# EAGLE design power_board (EAGLE 9.6.2)
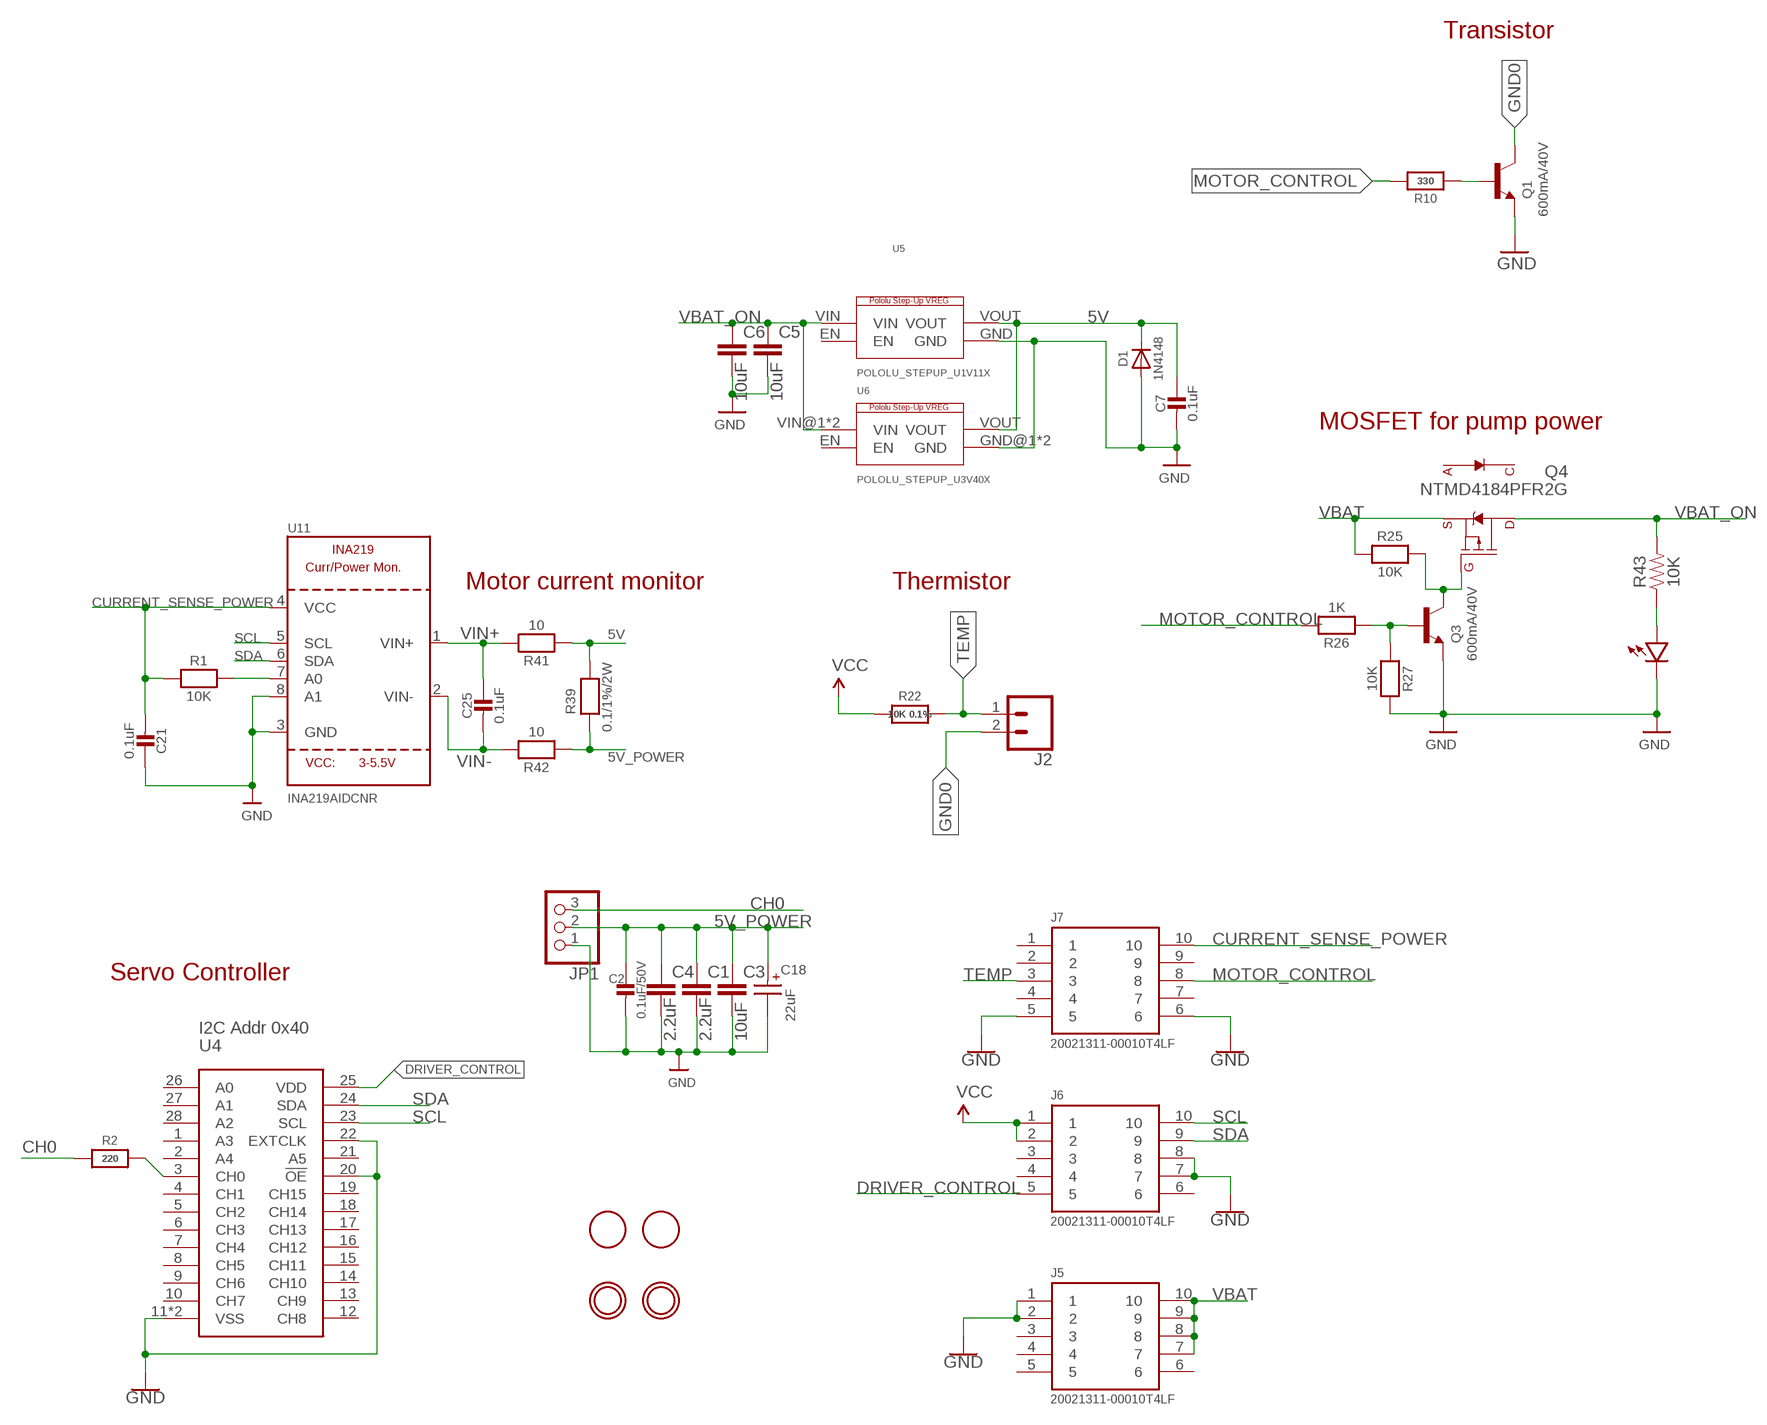
[diagram p0: schematic, sheet 1]

## Parts
C1  2.2uF  CAP1206  [1206]
C2  0.1uF/50V  CAP_CERAMIC0805-NOOUTLINE  [0805-NO]
C3  10uF  CAP0805  [0805]
C4  2.2uF  CAP1206  [1206]
C5  10uF  CAP1206  [1206]
C6  10uF  CAP1206  [1206]
C7  0.1uF  MICROBUILDER_CAP_CERAMIC_0402MP  [MICROBUILDER__0402MP]
C18  22uF  WCAP-ATLL_5X11_860160672011  [WCAP-ATLL_5X11(DXL)]
C21  0.1uF  MICROBUILDER_CAP_CERAMIC_0402MP  [MICROBUILDER__0402MP]
C25  0.1uF  MICROBUILDER_CAP_CERAMIC_0402MP  [MICROBUILDER__0402MP]
D1  1N4148  DIODESOD-323  [SOD-323]
J2  CONN_02  [1X02]
J5  20021311-00010T4LF  [HEADER_1.27MM_2X5]
J6  20021311-00010T4LF  [HEADER_1.27MM_2X5]
J7  20021311-00010T4LF  [HEADER_1.27MM_2X5]
JP1  PINHD-1X3  [1X03]
LED1  BLUE  LED0805  [0805-LED]
Q1  600mA/40V  TRANS_NPN-MMBT2222AL  [SOT23-3]
Q3  600mA/40V  TRANS_NPN-MMBT2222AL  [SOT23-3]
Q4  NTMD4184PFR2G  [SOIC-8]
R1  10K  MICROBUILDER_RESISTOR_0402MP  [MICROBUILDER__0402MP]
R2  220  MICROBUILDER_RESISTOR_0402MP  [MICROBUILDER__0402MP]
R10  330  MICROBUILDER_RESISTOR_0402MP  [MICROBUILDER__0402MP]
R22  10K 0.1%  MICROBUILDER_RESISTOR_0402MP  [MICROBUILDER__0402MP]
R25  10K  MICROBUILDER_RESISTOR_0402MP  [MICROBUILDER__0402MP]
R26  1K  MICROBUILDER_RESISTOR_0402MP  [MICROBUILDER__0402MP]
R27  10K  MICROBUILDER_RESISTOR_0402MP  [MICROBUILDER__0402MP]
R39  0.1/1%/2W  RESISTOR2512  [2512]
R41  10  MICROBUILDER_RESISTOR_0402MP  [MICROBUILDER__0402MP]
R42  10  MICROBUILDER_RESISTOR_0402MP  [MICROBUILDER__0402MP]
R43  10K  RESISTOR0805  [0805]
U4  PCA9685HVQFN28  [HVQFN28_SOT788-1]
U5  POLOLU_STEPUP_U1V11X  [POLOLU_STEPUP_U1V11X]
U6  POLOLU_STEPUP_U3V40X  [POLOLU_STEPUP_U3V40X]
U11  INA219AIDCNR  INA219  [SOT23-8]
U$2  MOUNTINGHOLE2.5  [MOUNTINGHOLE_2.5_PLATED]
U$3  MOUNTINGHOLE2.5  [MOUNTINGHOLE_2.5_PLATED]
U$8  FIDUCIAL  [FIDUCIAL_1MM]
U$9  FIDUCIAL  [FIDUCIAL_1MM]

## Nets
5V: C7.1 D1.C R39.2 R41.1 U5.VOUT U6.VOUT
5V_POWER: C1.1 C2.1 C3.1 C4.1 C18.1(+) JP1.2 R39.1 R42.1
CH0: JP1.3 R2.1
CURRENT_SENSE_POWER: C21.2 J7.10 R1.1 U11.4(VCC)
DRIVER_CONTROL: J6.5 U4.25(VDD)
GND [power]: C1.2 C2.2 C3.2 C4.2 C5.2 C6.2 C7.2 C18.2(-) C21.1 D1.A J5.1 J5.2 J6.7 J6.8 J7.5 J7.6 JP1.1 LED1.MINUS Q1.2(E) Q3.2(E) R27.2 U4.11(VSS) U4.20(!OE) U4.22(EXTCLK) U4.TH(VSS) U5.GND U6.GND@1(GND) U6.GND@2(GND) U11.3(GND) U11.8(A1)
GND0: J2.2 Q1.3(C)
MOTOR_CONTROL: J7.8 R10.2 R26.2
N$1 [power]: R1.2 U11.7(A0)
N$7: Q1.1(B) R10.1
N$9: R2.2 U4.3(CH0)
N$11: LED1.PLUS R43.1
N$32: Q3.3(C) Q4.4(G) R25.2
N$33: Q3.1(B) R26.1 R27.1
SCL: J6.10 U4.23(SCL) U11.5(SCL)
SDA: J6.9 U4.24(SDA) U11.6(SDA)
TEMP: J2.1 J7.3 R22.2
VBAT: J5.7 J5.8 J5.9 J5.10 Q4.3(S) R25.1
VBAT_ON [power]: C5.1 C6.1 Q4.5(D) Q4.6(D) R43.2 U5.VIN U6.VIN@1(VIN) U6.VIN@2(VIN)
VCC: J6.1 J6.2 R22.1
VIN+: C25.1 R41.2 U11.1(VIN+)
VIN-: C25.2 R42.2 U11.2(VIN-)
Unconnected: J5.3 J5.4 J5.5 J5.6 J6.3 J6.4 J6.6 J7.1 J7.2 J7.4 J7.7 J7.9 Q4.1(A) Q4.2(A) Q4.7(C) Q4.8(C) U4.1(A3) U4.2(A4) U4.4(CH1) U4.5(CH2) U4.6(CH3) U4.7(CH4) U4.8(CH5) U4.9(CH6) U4.10(CH7) U4.12(CH8) U4.13(CH9) U4.14(CH10) U4.15(CH11) U4.16(CH12) U4.17(CH13) U4.18(CH14) U4.19(CH15) U4.21(A5) U4.26(A0) U4.27(A1) U4.28(A2) U5.EN U6.EN

## Notes on the sheet
- Transistor
- MOSFET for pump power
- Motor current monitor | Thermistor
- Servo Controller
- I2C Addr 0x40

## Library data of the parts
C1 C3-C6 = SparkFun-Passives:CAP: Capacitor Standard 0603 ceramic capacitor, and 0.1" leaded capacitor.
C2 = microbuilder:CAP_CERAMIC: Ceramic Capacitors For new designs, use the packages preceded by an '_' character since they are more reliable: The following footprints should be used on most boards: _0402 - Standard footprint for regular board layouts _0603 - Standard footprint for regular board layouts _0805 - Standard footprint for regular board layouts _1206 - Standard footprint for regular board layouts For extremely tight-pitch boards where space is at a premium, the following 'micro-pitch' footprints can be used (smaller pads, no silkscreen outline, etc.): _0402MP - Micro-pitch footprint for very dense/compact boards _0603MP - Micro-pitch footprint for very dense/compact boards _0805MP - Micro-pitch footprint for very dense/compact boards _1206MP - Micro-pitch footprint for very dense/compact boards
C7 C21 C25 = Adafruit Feather 32u4 Bluefruit LE:MICROBUILDER_CAP_CERAMIC: Ceramic Capacitors For new designs, use the packages preceded by an '_' character since they are more reliable: The following footprints should be used on most boards: _0402 - Standard footprint for regular board layouts _0603 - Standard footprint for regular board layouts _0805 - Standard footprint for regular board layouts _1206 - Standard footprint for regular board layouts For extremely tight-pitch boards where space is at a premium, the following 'micro-pitch' footprints can be used (smaller pads, no silkscreen outline, etc.): _0402MP - Micro-pitch footprint for very dense/compact boards _0603MP - Micro-pitch footprint for very dense/compact boards _0805MP - Micro-pitch footprint for very dense/compact boards _1206MP - Micro-pitch footprint for very dense/compact boards; MPN: GRM155R71C104KA88J
C18 = 860160672011_Eagle_WCAP-ATLL_rev20a:WCAP-ATLL_5X11: WCAP-ATLL Aluminum Electrolytic Capacitors Long Life +105 °C Characteristics Long life product series Mounting style: THT Radial Capacitance range: 0.47 µF ‒ 6800 µF Capacitance tolerance: ±20 % Voltage range (UR): 10 ‒ 50 V(DC) Operating temperature: -55 °C up to +105 °C Endurance: 3000 ‒ 10000 h @ +105 °C Dimensions (DxL) in mm: 5.0 x 11.0 up to 18.0 x 35.5 Recommended soldering: Wave soldering Applications Long life application Filtering Smoothing Energy storage Coupling e.g. Switched-mode power supply, AC/DC converter, adapter, charger, digital camera <https://www.we-online.com/catalog/media/o14730v209%20Family_WCAP-ATLL.jpg> Details see: https://www.we-online.com/catalog/en/WCAP-ATLL/ Updated by yingchun,Shan;2020-03-02 2020(C) Würth Elektronik; DATASHEET-URL: https://www.we-online.com/catalog/datasheet/860160672011.pdf; DF: 10%; DIAMETER: 5mm; I-LEAK: 11uA; I-RIPPLE: 162mA; L: 11mm; MPN: 860160672011; OPERATING-TEMPERATURE: -55 °C up to +105 °C; PART-NUMBER: 860160672011; PITCH: 2mm; TECHNICAL-REFERENCE: ATEC110220M050DSPA3C000; VALUE: 22 µF; VR: 50V(DC)
D1 = microbuilder:DIODE: Diode SMA Model Volts Amps Type Vf Ir Digikey # Notes SSA34-E3 40V 3A Schottky 480mV @ 3A 200uA @ 40V SSA34-E3/61TGITR-ND CDBA120-G 20V 1A Schottky 500mV @ 1A 500uA @ 20V 641-1014-6-ND REEL MBRA210 10V 2A Schottky 350mV @ 2A 700uA @ 10V MBRA210LT3 SOD-123 Model Volts Amps Type Vf Ir Order # Notes BAT54T1G 30V 200mA Schottky 800mV @ 200mA 2uA @ 25V BAT54T1GOSTR-ND B0530W 30V 500mA Schottky 430mV @ 500mA 130uA @ 30V B0530W-FDICT-ND REEL MBR120 20V 1A Schottky 340mV @ 1A MBR120VLSFT1GOSCT-ND SOD-323 Model Volts Amps Type Vf Ir Order # Notes PMEG2005EJ 20V 500mA Schottky 355mV @ 500mA 568-4110-1-ND ZLLS410 10V 570mA Schottky 380mV @ 570mA ZLLS410CT-ND 1N4148WS 75V 150mA Silicon/Simple 1V 1N4148WSFSCT-ND REEL SOD-523 Model Volts Amps Type Vf Ir Order # Notes BAT54XV2 30V 200mA Schottky 0.8V @ 100mA BAT54XV2CT-ND TB751S 30V 30mA Schottky RB751S-40TE61CT-ND SOT23-R/W (R = Solder Paste/Reflow Ovens, W = Hand-Soldering) Model Volts Amps Type Vf Ir Order # Notes BAT54FILM 40V 300mA Schottky 497-7162-1-ND POWERDI-5 Model Volts Amps Type Vf Ir Order # Notes PDS560 60V 5A Schottky 670mV @ 5A 150uA @ 60V PDS560DICT-ND; MPN: 1N4148WX-TP
J2 = SparkFun-Connectors:CONN_02: Multi connection point. Often used as Generic Header-pin footprint for 0.1 inch spaced/style header connections On any of the 0.1 inch spaced packages, you can populate with these: Break Away Headers - Straight <https://www.sparkfun.com/products/116> (PRT-00116) Break Away Male Headers - Right Angle <https://www.sparkfun.com/products/553> (PRT-00553) Female Headers <https://www.sparkfun.com/products/115> (PRT-00115) Break Away Headers - Machine Pin <https://www.sparkfun.com/products/117> (PRT-00117) Break Away Female Headers - Swiss Machine Pin <https://www.sparkfun.com/products/743> (PRT-00743) For SCREWTERMINALS and SPRING TERMINALS visit here: Screw Terimnals on SparkFun.com <https://www.sparkfun.com/search/results?term=Screw+Terminals> (5mm/3.5mm/2.54mm spacing) This device is also useful as a general connection point to wire up your design to another part of your project. Our various solder wires solder well into these plated through hole pads. Hook-Up Wire - Assortment (Stranded, 22 AWG) <https://www.sparkfun.com/products/11375> (PRT-11375) Hook-Up Wire - Assortment (Solid Core, 22 AWG) <https://www.sparkfun.com/products/11367> (PRT-11367) View the entire wire category on our website here <https://www.sparkfun.com/categories/141> Special notes: Molex polarized connector foot print use with: PRT-08233 with associated crimp pins and housings. 2.54_SCREWTERM for use with PRT-10571. 3.5mm Screw Terminal footprints for PRT-08084 5mm Screw Terminal footprints for use with PRT-08432
J5-J7 = Amphenol:20021311-00010T4LF
JP1 = adafruit:PINHD-1X3: PIN HEADER
LED1 = LowPowerLab:LED; MPN: 150080BS75000
Q1 Q3 = SparkFun-DiscreteSemi:TRANS_NPN: NPN transistor Current controlled devices typically used to amplify current or used as a switch. BC547 - COM-08928 <http://www.sparkfun.com/products/8928> (TO-92 45V 100mA) (1.Collector 2.Base 3.Emitter) 2N3904 - COM-00521 <http://www.sparkfun.com/products/521> (TO-92 40V 200mA) (1.Emitter 2.Base 3.Collector) P2N2222A - COM-12852 <http://www.sparkfun.com/products/12852> (TO-92 40V 600mA) (1.Collector 2.Base 3.Emitter); MPN: MMBT3904-TP; PROD_ID: TRANS-08049
Q4 = NTMD4184PFR2G:NTMD4184PFR2G: MOSFET – Power, Single, P-Channel, Schottky Diode, Schottky Barrier Diode -30 V, -4.0 A, 20 V, 2.2A MPN: NTMD4184PFR2G Designed by AKstudios github.com/akstudios; MPN: NTMD4184PFR2G
R1 R25 R27 = Adafruit Feather 32u4 Bluefruit LE:MICROBUILDER_RESISTOR: Resistors For new designs, use the packages preceded by an '_' character since they are more reliable: The following footprints should be used on most boards: _0402 - Standard footprint for regular board layouts _0603 - Standard footprint for regular board layouts _0805 - Standard footprint for regular board layouts _1206 - Standard footprint for regular board layouts For extremely tight-pitch boards where space is at a premium, the following 'micro-pitch' footprints can be used (smaller pads, no silkscreen outline, etc.): _0402MP - Micro-pitch footprint for very dense/compact boards _0603MP - Micro-pitch footprint for very dense/compact boards _0805MP - Micro-pitch footprint for very dense/compact boards _1206MP - Micro-pitch footprint for very dense/compact boards; MPN: RC0402FR-7W10KL
R2 = Adafruit Feather 32u4 Bluefruit LE:MICROBUILDER_RESISTOR: Resistors For new designs, use the packages preceded by an '_' character since they are more reliable: The following footprints should be used on most boards: _0402 - Standard footprint for regular board layouts _0603 - Standard footprint for regular board layouts _0805 - Standard footprint for regular board layouts _1206 - Standard footprint for regular board layouts For extremely tight-pitch boards where space is at a premium, the following 'micro-pitch' footprints can be used (smaller pads, no silkscreen outline, etc.): _0402MP - Micro-pitch footprint for very dense/compact boards _0603MP - Micro-pitch footprint for very dense/compact boards _0805MP - Micro-pitch footprint for very dense/compact boards _1206MP - Micro-pitch footprint for very dense/compact boards; MPN: RC0402JR-071KL
R10 = Adafruit Feather 32u4 Bluefruit LE:MICROBUILDER_RESISTOR: Resistors For new designs, use the packages preceded by an '_' character since they are more reliable: The following footprints should be used on most boards: _0402 - Standard footprint for regular board layouts _0603 - Standard footprint for regular board layouts _0805 - Standard footprint for regular board layouts _1206 - Standard footprint for regular board layouts For extremely tight-pitch boards where space is at a premium, the following 'micro-pitch' footprints can be used (smaller pads, no silkscreen outline, etc.): _0402MP - Micro-pitch footprint for very dense/compact boards _0603MP - Micro-pitch footprint for very dense/compact boards _0805MP - Micro-pitch footprint for very dense/compact boards _1206MP - Micro-pitch footprint for very dense/compact boards; MPN: RC0402JR-0710KL
R22 = Adafruit Feather 32u4 Bluefruit LE:MICROBUILDER_RESISTOR: Resistors For new designs, use the packages preceded by an '_' character since they are more reliable: The following footprints should be used on most boards: _0402 - Standard footprint for regular board layouts _0603 - Standard footprint for regular board layouts _0805 - Standard footprint for regular board layouts _1206 - Standard footprint for regular board layouts For extremely tight-pitch boards where space is at a premium, the following 'micro-pitch' footprints can be used (smaller pads, no silkscreen outline, etc.): _0402MP - Micro-pitch footprint for very dense/compact boards _0603MP - Micro-pitch footprint for very dense/compact boards _0805MP - Micro-pitch footprint for very dense/compact boards _1206MP - Micro-pitch footprint for very dense/compact boards; MPN: RC0402JR-0727RL
R26 = Adafruit Feather 32u4 Bluefruit LE:MICROBUILDER_RESISTOR: Resistors For new designs, use the packages preceded by an '_' character since they are more reliable: The following footprints should be used on most boards: _0402 - Standard footprint for regular board layouts _0603 - Standard footprint for regular board layouts _0805 - Standard footprint for regular board layouts _1206 - Standard footprint for regular board layouts For extremely tight-pitch boards where space is at a premium, the following 'micro-pitch' footprints can be used (smaller pads, no silkscreen outline, etc.): _0402MP - Micro-pitch footprint for very dense/compact boards _0603MP - Micro-pitch footprint for very dense/compact boards _0805MP - Micro-pitch footprint for very dense/compact boards _1206MP - Micro-pitch footprint for very dense/compact boards; MPN: RC0402FR-101KL
R39 = microbuilder:RESISTOR: Resistors 0402 - 0402 Surface Mount Package 22 Ohm 1% 1/16W [Digikey: 311-22.0LRTR-ND] 33 Ohm 5% 1/16W 1.0K 5% 1/16W 1.5K 5% 1/16W 2.0K 1% 1/16W 10.0K 1% 1/16W [Digikey: 311-10.0KLRTR-ND] 10.0K 5% 1/16W [Digikey: RMCF0402JT10K0TR-ND] 12.1K 1% 1/16W [Digikey: 311-22.0LRTR-ND] 100.0K 5% 1/16W 0603 - 0603 Surface Mount Package 0 Ohm 1/10 Watt 1% Resistor 15 Ohm 1/10 Watt 1% Resistor 33 Ohm 1/10 Watt 1% Resistor 49.9 Ohm 1/10 Watt 1% Resistor 100 Ohm 1/10 Watt 1% Resistor 150 Ohm 1/10 Watt 1% Resistor 240 Ohm 1/10 Watt 1% Resistor 390 Ohm 1/10 Watt 1% Resistor 560 Ohm 1/10 Watt 1% Resistor 680 Ohm 1/10 Watt 1% Resistor 750 Ohm 1/10 Watt 1% Resistor 1.0K Ohm 1/10 Watt 1% Resistor 1.5K Ohm 1/10 Watt 1% Resistor 2.0K Ohm 1/10 Watt 1% Resistor 2.2K Ohm 1/10 Watt 1% Resistor 3.3K Ohm 1/10 Watt 1% Resistor 4.7K Ohm 1/10 Watt 1% Resistor 10.0K Ohm 1/10 Watt 1% Resistor 12.0K Ohm 1/10 Watt 1% Resistor 12.1K Ohm 1/10 Watt 1% Resistor 20.0K Ohm 1/10 Watt 1% Resistor 33.0K Ohm 1/10 Watt 1% Resistor 100.0K Ohm 1/10 Watt 1% Resistor 0805 - 0805 Surface Mount Package 0 Ohm 1/8 Watt 1% Resistor 33 Ohm 1/8 Watt 1% Resistor 100 Ohm 1/8 Watt 1% Resistor 150 Ohm 1/8 Watt 1% Resistor 200 Ohm 1/8 Watt 1% Resistor 240 Ohm 1/8 Watt 1% Resistor 330 Ohm 1/8 Watt 1% Resistor 390 Ohm 1/8 Watt 1% Resistor 470 Ohm 1/8 Watt 1% Resistor 1.0K Ohm 1/8 Watt 1% Resistor 1.5K Ohm 1/8 Watt 1% Resistor 2.0K Ohm 1/8 Watt 1% Resistor 4.7K Ohm 1/8 Watt 1% Resistor 5.1K Ohm 1/8 Watt 1% Resistor 5.6K Ohm 1/8 Watt 1% Resistor 10.0K Ohm 1/8 Watt 1% Resistor 22.0K Ohm 1/8 Watt 1% Resistor 33.0K Ohm 1/8 Watt 1% Resistor 100K Ohm 1/8 Watt 1% Resistor 1206 - 1206 Surface Mount Package 2012 - 2010 Surface Mount Package 0.11 Ohm 1/2 Watt 1% Resistor - Digikey: RHM.11UCT-ND; MPN: RCWE2512R100FKEA
R41 R42 = Adafruit Feather 32u4 Bluefruit LE:MICROBUILDER_RESISTOR: Resistors For new designs, use the packages preceded by an '_' character since they are more reliable: The following footprints should be used on most boards: _0402 - Standard footprint for regular board layouts _0603 - Standard footprint for regular board layouts _0805 - Standard footprint for regular board layouts _1206 - Standard footprint for regular board layouts For extremely tight-pitch boards where space is at a premium, the following 'micro-pitch' footprints can be used (smaller pads, no silkscreen outline, etc.): _0402MP - Micro-pitch footprint for very dense/compact boards _0603MP - Micro-pitch footprint for very dense/compact boards _0805MP - Micro-pitch footprint for very dense/compact boards _1206MP - Micro-pitch footprint for very dense/compact boards; MPN: RC0402FR-0710RL
R43 = SparkFun-Resistors:RESISTOR: Generic Resistor Package; MPN: RK73B2ATTD103J
U4 = PCA9685:PCA9685: 16-channel 12-bit PWM I2C interface Internal Oscillator 40Hz to 1kHz Can be totem pole or open collector 2.3V to 5.5V SparkFun Products SparkFun Block for Intel® Edison - PWM <https://www.sparkfun.com/products/13042> (DEV-13042) PROTO: IC-12240 PROD_ID: IC-12271
U5 = Pololu Step Up Vregs:POLOLU_STEPUP_U1V11X
U6 = Pololu Step Up Vregs:POLOLU_STEPUP_U3V40X
U11 = microbuilder:INA219: INA219 - I2C Current/Power Monitor Voltage Range: 0-26V Accuracy: 0.5% Temperature: -40°C - 125°C; MPN: INA219AIDCNR
U$2 U$3 = ADS1x15:MOUNTINGHOLE: Mounting Hole For #2 screws (0.086"/2.18mm width, 0.094"/2.4mm hole) use 2.5mm
U$8 U$9 = adafruit:FIDUCIAL: For use by pick and place machines to calibrate the vision/machine, 1mm By microbuilder.eu

## Net classes
0 default: width 0.152 mm, drill 0.305 mm, clearance 0.152 mm
1 power: width 0.381 mm, clearance 0.254 mm

## Board
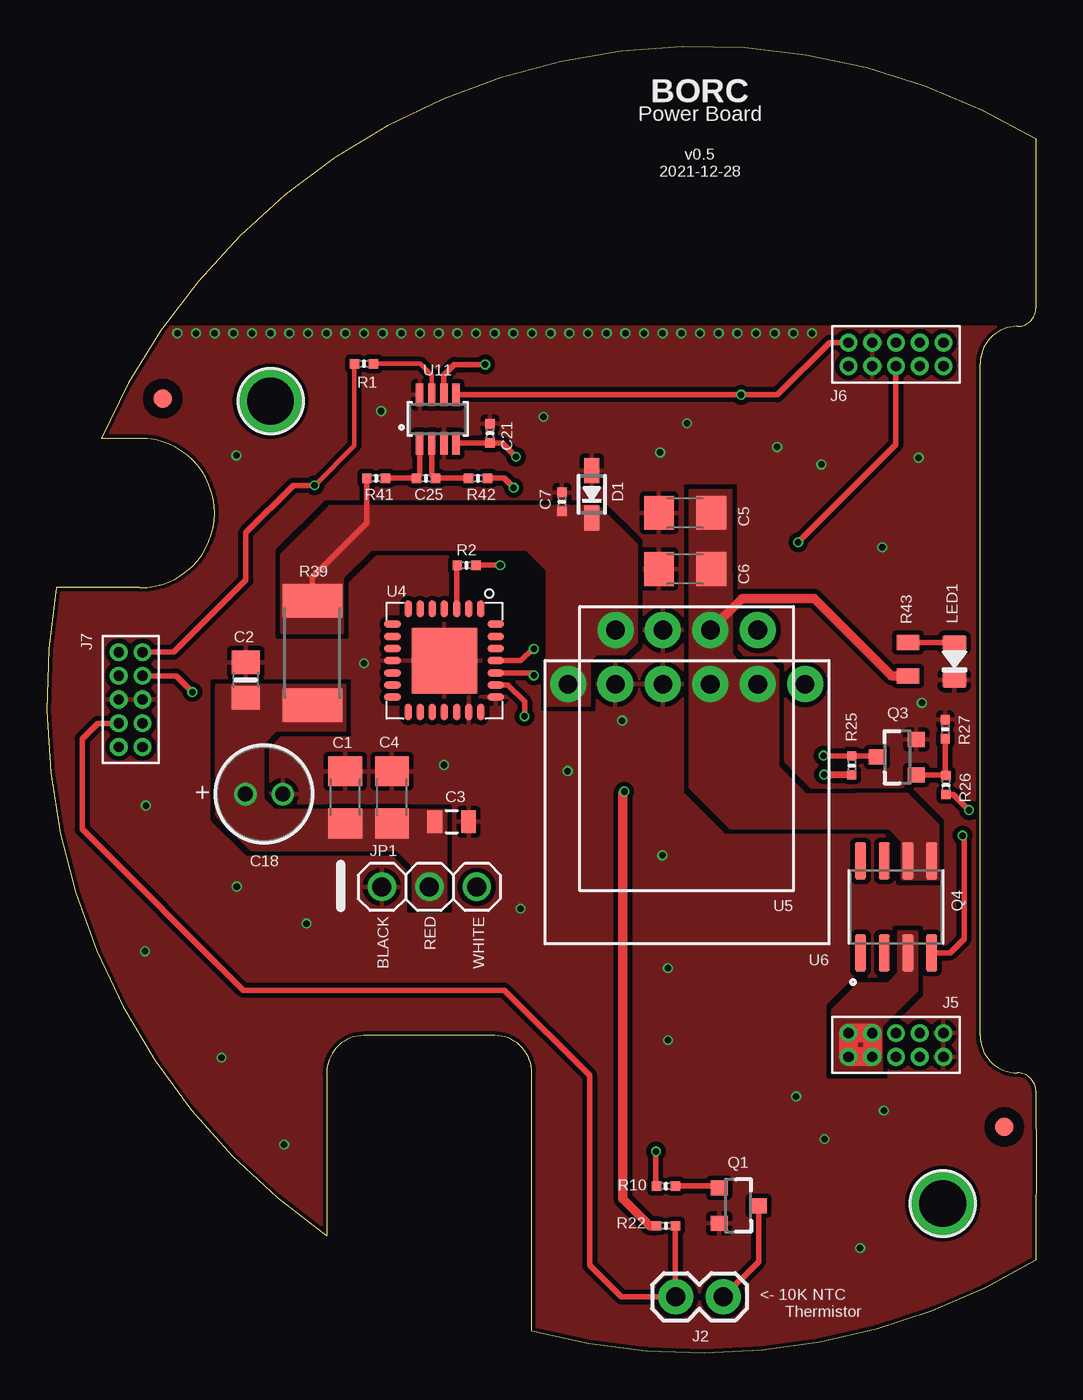
[diagram p1: board, top side]
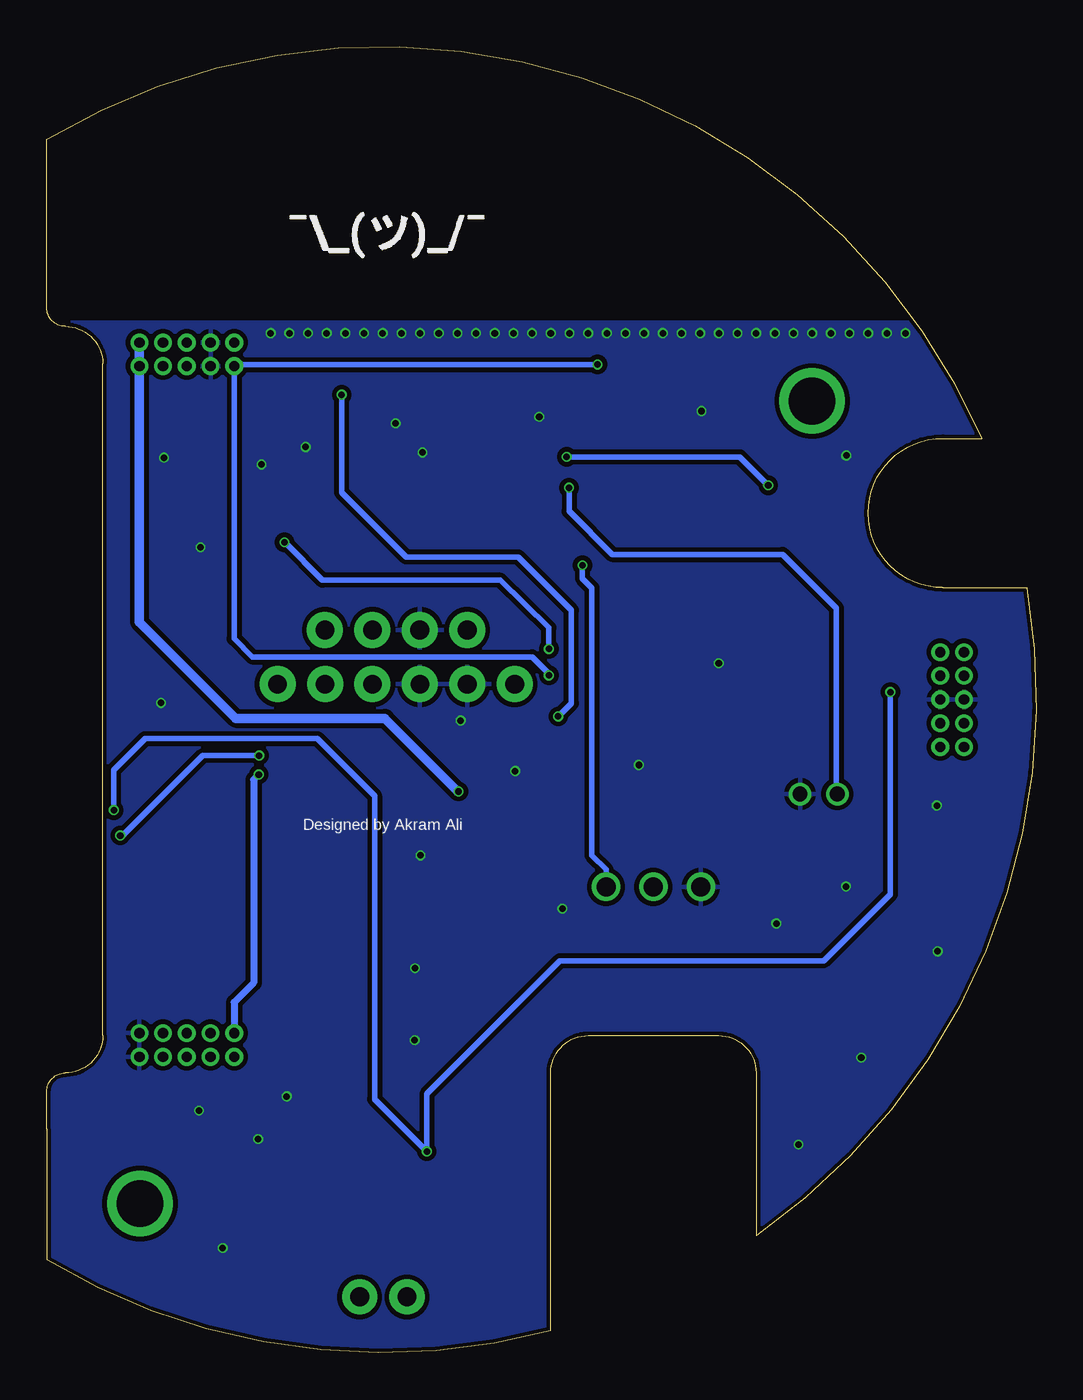
[diagram p2: board, bottom side, seen from below]

Size 53 x 69.99 mm. Coordinates in mm from the lower left corner, seen from the top.
Outline: 53,14 arc90 52,15 arc-90 50,17 50,53 arc-90 52,55 arc90 53,56 53,65.02 arc97 2.92,49 5,49 arc-180 5,41 0.51,41 arc65 15,6.28 15,15 arc-90 17,17 24,17 arc-90 26,15 26,1.18 arc46 52.98,4.97 53,12 53,14
Copper layers (1*16): Top 0.035559375mm / dielectric 1.6mm / Bottom 0.035559375mm
Design rules "jlcpcb2layer": minimum track width 5mil, minimum drill 12mil, track to track 5mil, track to pad 5mil, pad to pad 5mil, via to via 5mil, smd to smd 5mil, copper to edge 8mil, drill to drill 6mil, minimum pad ring 5mil, minimum via ring 3mil, stop-mask expansion 2.5mil, vias tented up to drill 0mil, thermal gap 10mil

### Footprints (pad centres in the part's own frame; a part is rotated, then mirrored left to right if it is on the bottom)
1206 = smd 1.6 x 1.8: 1 -1.4,0; 2 1.4,0
0805-NO = smd 1.24 x 1.5: 1 -0.95,0; 2 0.95,0
0805 = smd 0.8 x 1.2: 1 -0.9,0; 2 0.9,0
MICROBUILDER__0402MP = smd 0.5 x 0.5: 1 -0.508,0; 2 0.508,0
WCAP-ATLL_5X11(DXL) = drill 0.8: 1 1,0; 2 -1,0
SOD-323 = smd 1.35 x 0.8: A 1.27,0; C -1.27,0
1X02 = drill 1.016 pad 1.88: 1 0,0; 2 2.54,0
HEADER_1.27MM_2X5 = drill 0.55 pad 0.95: 1 0.865,0.865; 2 2.135,0.865; 3 0.865,2.135; 4 2.135,2.135; 5 0.865,3.405; 6 2.135,3.405; 7 0.865,4.675; 8 2.135,4.675; 9 0.865,5.945; 10 2.135,5.945
1X03 = drill 1.016: 1 -2.54,0; 2 0,0; 3 2.54,0
0805-LED = smd 0.8 x 1.3: MINUS -1,0; PLUS 1,0
SOT23-3 = smd 0.8 x 0.9: 1 -0.95,-1; 2 0.95,-1; 3 0,1.1
SOIC-8 = smd 1.97 x 0.6: 1 -2.47,1.905; 2 -2.47,0.635; 3 -2.47,-0.635; 4 -2.47,-1.905; 5 2.47,-1.905; 6 2.47,-0.635; 7 2.47,0.635; 8 2.47,1.905
2512 = smd 1.8 x 3.2: 1 -2.8,0; 2 2.8,0
HVQFN28_SOT788-1 = smd 0.9 x 0.4: 1 1.035,5.76; 2 1.035,5.11; 3 1.035,4.46; 4 1.035,3.81; 5 1.035,3.16; 6 1.035,2.51; 7 1.035,1.86; 15 6.56,1.86; 16 6.56,2.51; 17 6.56,3.16; 18 6.56,3.81; 19 6.56,4.46; 20 6.56,5.11; 21 6.56,5.76 | smd 0.4 x 0.9: 8 1.86,1.035; 9 2.51,1.035; 10 3.16,1.035; 11 3.81,1.035; 12 4.46,1.035; 13 5.11,1.035; 14 5.76,1.035; 22 5.76,6.56; 23 5.11,6.56; 24 4.46,6.56; 25 3.81,6.56; 26 3.16,6.56; 27 2.51,6.56; 28 1.86,6.56 | smd 3.5 x 3.5: TH 3.81,3.81
POLOLU_STEPUP_U1V11X = drill 1 pad 1.93: EN 1.905,1.27; GND 6.985,1.27; VIN 4.445,1.27; VOUT 9.525,1.27
POLOLU_STEPUP_U3V40X = drill 1 pad 1.93: EN 1.27,1.27; GND@1 8.89,1.27; GND@2 11.43,1.27; VIN@1 3.81,1.27; VIN@2 6.35,1.27; VOUT 13.97,1.27
SOT23-8 = smd 0.4 x 1.2: 1 -0.975,-1.3; 2 -0.325,-1.3; 3 0.325,-1.3; 4 0.975,-1.3; 5 0.975,1.3; 6 0.325,1.3; 7 -0.325,1.3; 8 -0.975,1.3
MOUNTINGHOLE_2.5_PLATED = drill 2.5 pad 3.2: P$1 0,0
FIDUCIAL_1MM = smd 1 x 1: 1 0,0

### Placement (x,y rotation side)
C1  16,29.76 90 top
C2  10.68,36.05 90 top
C3  21.7,28.46 0 top
C4  18.5,29.76 90 top
C5  34.2,45 180 top
C6  34.2,42 180 top
C7  27.6,45.6 90 top
C18  11.64,29.94 180 top
C21  23.74,49.28 270 top
C25  20.32,46.86 0 top
D1  29.2,46 90 top
J2  33.7,3 0 top
J5  48.9,15 90 top
J6  48.9,52 90 top
J7  3,31.6 0 top
JP1  20.5,24.97 0 top
LED1  48.62,37.04 90 top
Q1  37.03,7.89 270 top
Q3  45.58,31.92 90 top
Q4  45.5,23.9 90 top
R1  17,53 0 top
R2  22.5,42.2 180 top
R10  33.17,8.94 180 top
R22  33.17,6.81 0 top
R25  43.12,31.47 90 top
R26  48.17,30.43 270 top
R27  48.13,33.42 90 top
R39  14.23,37.49 90 top
R41  17.65,46.86 0 top
R42  23.11,46.86 180 top
R43  46.12,37.17 270 top
U4  17.5,40.9 270 top
U5  40,40 180 top
U6  41.9,37.1 180 top
U11  20.95,50.04 0 top
U$2  12,51 0 top
U$3  48,8 0 top
U$8  51.3,12.1 0 top
U$9  6.21,51.13 0 top

### Tracks (layer width: path | path; a pad name or v marks a point on that pad's centre or on a via)
5V
  Top 0.305: R41.1 17.14,44.45 14.23,41.54 R39.2
  pour Top (no thermals): 12.57,38.61 15.87,38.61 15.87,41.53 17.42,43.08 25.65,43.08 26.8,41.94 26.8,34.7 29.1,34.7 29.1,37.07 29.5,37.47 31,37.47 31.6,38.07 31.6,43.3 29.54,45.36 15.16,45.36 12.57,42.76
5V_POWER  (via drill 0.35)
  Top 0.305: R42.1 24.51,46.86 v25.01,46.35
  Bottom 0.305: v25.01,46.35 25.01,45.09 22.71,42.79 13.58,42.79 10.7,39.9 10.7,29.99 C18.1
  pour Top (no thermals): 9.1,35.76 9.1,28.8 10.93,26.96 18.74,26.96 19.6,26.11 19.6,23.92 21.4,23.92 21.4,29.06 12.2,29.06 11.6,29.67 11.6,32.66 12.3,33.36 16,33.36 16,35.76
CH0  (via drill 0.35)
  Top 0.305: R2.1 v24.3,42.2
  Bottom 0.305: v24.3,42.2 24.3,41.49 23.8,40.99 23.8,26.66 23.04,25.9 JP1.3
CURRENT_SENSE_POWER  (via drill 0.35)
  Top 0.254: R1.1 16.49,48.62 v14.35,46.48
  Top 0.305: C21.2 23.71,48.74 | 23.71,48.74 U11.4 | v25.14,48.01 24.41,48.74 23.71,48.74 | J7.10 6.81,37.54 10.66,41.4 10.66,43.94 13.2,46.48 v14.35,46.48
  Bottom 0.305: v14.35,46.48 15.87,48.01 v25.14,48.01
DRIVER_CONTROL  (via drill 0.35)
  Top 0.305: J6.5 45.49,48.67 v40.25,43.43 | U4.25 25.4,37.09 26.03,37.72 v26.1,37.72
  Bottom 0.305: v26.1,37.72 26.1,38.85 28.7,41.4 38.22,41.4 v40.25,43.43
GND  (via drill 0.35)
  other vias: 24,54.63 25,54.63 27,54.63 28,54.63 29,54.63 30,54.63 23,54.63 22,54.63 20,54.63 19,54.63 18,54.63 17,54.63 15,54.63 14,54.63 12,54.63 11,54.63 10,54.63 9,54.63 8,54.63 41,54.63 32,54.63 33,54.63 34,54.63 36,54.63 37,54.63 38,54.63 39,54.63 13,54.63 7,54.63 16,54.63 21,54.63 26,54.63 31,54.63 35,54.63 40,54.63 5.31,29.32 12.72,11.16 9.37,15.82 13.92,23 10.18,24.99 27.9,31.17 30.82,33.88 32.86,48.24 39.13,48.54 26.61,50.15 34.3,49.81 46.71,47.97 41.49,47.6 5.27,21.51 44.76,43.16 46.87,34.82 33.27,20.61 33.28,16.76 32.98,26.66 44.84,12.98 41.67,11.45 43.57,5.61 40.14,13.74 17.92,50.46 21.28,31.5 17,36.95 10.16,48.08 25.38,23.8
  pour Top (rank 6): -1,-1 -1,54.98 55,54.98 55,-1
  pour Bottom (rank 6): -2,-2 -2,55.22 56,55.22 56,-2
GND0
  Top 0.305: J2.2 38.13,4.89 Q1.3
MOTOR_CONTROL  (via drill 0.35)
  Top 0.305: R26.2 48.56,29.92 v49.4,29.08 | J7.8 6.94,36.27 v7.8,35.41 | R10.2 32.63,8.96 v32.63,10.79
  Bottom 0.305: v49.4,29.08 49.4,31.24 47.72,32.92 38.5,32.92 35.43,29.84 35.43,13.59 v32.63,10.79 32.63,13.87 25.51,21 11.38,21 7.8,24.58 v7.8,35.41
N$1
  Top 0.254: U11.7 20.63,52.39 20.02,53 R1.2
N$7
  Top 0.305: R10.1 35.93,8.94 Q1.1
N$9
  Top 0.305: U4.3 21.96,42.17 R2.2
N$11
  Top 0.305: R43.1 48.59,38.07 LED1.PLUS
N$32  (via drill 0.35)
  Top 0.305: Q4.4 48.39,21.43 49.14,22.18 49.14,27.63 v49.06,27.72 | v41.61,32.01 41.64,31.98 R25.2 44.42,31.98 Q3.3
  Bottom 0.305: v41.61,32.01 44.63,32.01 48.91,27.72 v49.06,27.72
N$33
  Top 0.305: Q3.1 48.13,30.97 R26.1 48.13,30.97 R27.1
SCL  (via drill 0.35)
  Top 0.305: J6.10 41.94,54.13 39.14,51.34 v37.2,51.34 U11.5 | U4.23 24.71,35.79 25.6,34.9 v25.6,34.1
  Bottom 0.305: v25.6,34.1 24.9,34.8 24.9,39.8 27.74,42.64 33.74,42.64 37.2,46.1 v37.2,51.34
SDA  (via drill 0.35)
  Top 0.305: U11.6 21.28,52.39 21.84,52.96 v23.49,52.96 | v26.1,36.3 25.96,36.44 U4.24
  Bottom 0.305: v23.49,52.96 42.79,52.96 42.92,52.83 J6.9 42.95,38.26 41.98,37.3 26.99,37.3 26.1,36.4 v26.1,36.3
TEMP
  Top 0.305: J7.3 2.74,33.73 1.9,32.89 1.9,28.07 10.54,19.43 24.51,19.43 29.08,14.86 29.08,4.7 30.78,3 J2.1 33.68,3.02 R22.2
VBAT  (via drill 0.35)
  Top 0.381: R25.1 41.66,30.96 v41.64,30.99
  Top 1.016: J5.10 J5.8 J5.7 J5.9 J5.10
  Bottom 0.381: v41.64,30.99 41.91,30.72 41.91,19.83 42.95,18.79 J5.10
  pour Top (no thermals): 45.63,22.58 46.6,22.58 46.6,19.4 44.7,17.5 44.7,15 42.1,15 42.1,18.4 43.5,19.8 45.1,19.8 45.63,20.38
VBAT_ON
  Top 0.508: R43.2 45.27,36.27 41.11,40.43 37.25,40.43 U5.VIN
  pour Top (no thermals): 45.81,25.4 47.77,25.4 47.77,28.27 46.09,29.95 40.69,29.9 39.2,31.4 39.2,36.6 38.8,37 37.11,37 36.7,37.41 36.67,46.2 34.44,46.2 34.44,30.3 36.59,28.15 45.1,28.15 45.81,27.44
VCC  (via drill 0.35)
  Top 0.508: R22.1 32.3,6.81 30.86,8.25 30.86,30 v30.94,30.08
  Bottom 0.508: J6.2 J6.1 48.03,39.16 42.87,34 34.88,34 30.96,30.08 v30.94,30.08
VIN+
  Top 0.305: U11.1 19.98,47.03 C25.1 R41.2
VIN-
  Top 0.305: U11.2 20.63,47.06 C25.2 R42.2

### Text on the board
tPlace: BORC | Power Board | v0.5 / 2021-12-28 | BLACK | RED | WHITE | <- 10K NTC / Thermistor
bPlace: Designed by Akram Ali